# Altium schematic sheet IO-Expander.SchDoc
size A4
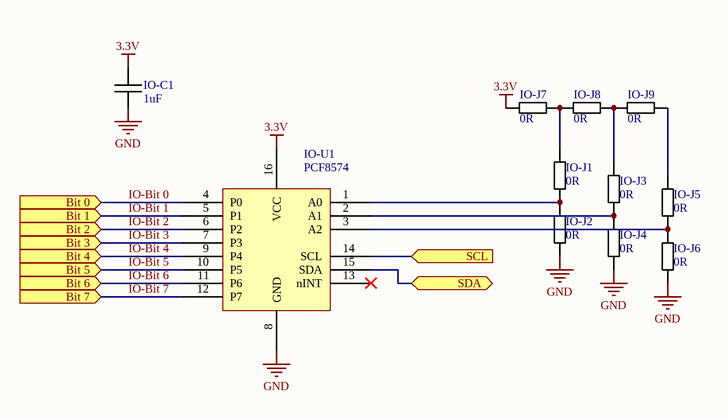
[diagram p0: IO-Expander.SchDoc]

## Parts
IO-C1  1uF  [C 0805 / 2012]
IO-J1  0R  [R 0805 / 2012]
IO-J2  0R  [R 0805 / 2012]
IO-J3  0R  [R 0805 / 2012]
IO-J4  0R  [R 0805 / 2012]
IO-J5  0R  [R 0805 / 2012]
IO-J6  0R  [R 0805 / 2012]
IO-J7  0R  [R 0805 / 2012 wide]
IO-J8  0R  [R 0805 / 2012 wide]
IO-J9  0R  [R 0805 / 2012 wide]
IO-U1  PCF8574  [SOIC-16W]

## Ports
Bit 0 (in), Bit 1 (in), Bit 2 (in), Bit 3 (in), Bit 4 (in), Bit 5 (in), Bit 6 (in), Bit 7 (in), SCL (in), SDA (bidir)

## Nets
3.3V: IO-C1.1 IO-J7.2 IO-U1.16(VCC)
GND: IO-C1.2 IO-J2.1 IO-J4.1 IO-J6.1 IO-U1.8(GND)
IO-Bit 0: IO-U1.4(P0) ; port Bit 0
IO-Bit 1: IO-U1.5(P1) ; port Bit 1
IO-Bit 2: IO-U1.6(P2) ; port Bit 2
IO-Bit 3: IO-U1.7(P3) ; port Bit 3
IO-Bit 4: IO-U1.9(P4) ; port Bit 4
IO-Bit 5: IO-U1.10(P5) ; port Bit 5
IO-Bit 6: IO-U1.11(P6) ; port Bit 6
IO-Bit 7: IO-U1.12(P7) ; port Bit 7
SCL: IO-U1.14(SCL) ; port SCL
SDA: IO-U1.15(SDA) ; port SDA
NetIO-J1_1: IO-J1.1 IO-J2.2 IO-U1.1(A0)
NetIO-J1_2: IO-J1.2 IO-J7.1 IO-J8.2
NetIO-J3_1: IO-J3.1 IO-J4.2 IO-U1.2(A1)
NetIO-J3_2: IO-J3.2 IO-J8.1 IO-J9.2
NetIO-J5_1: IO-J5.1 IO-J6.2 IO-U1.3(A2)
NetIO-J5_2: IO-J5.2 IO-J9.1

Not connected (* = marked no-connect by the designer): IO-U1 13(nINT)*

## Library data of the parts
IO-C1 = Capacitor
IO-J1-IO-J9 = Resistor
IO-U1 = PCF8574: 8-Bit I/O-Expander